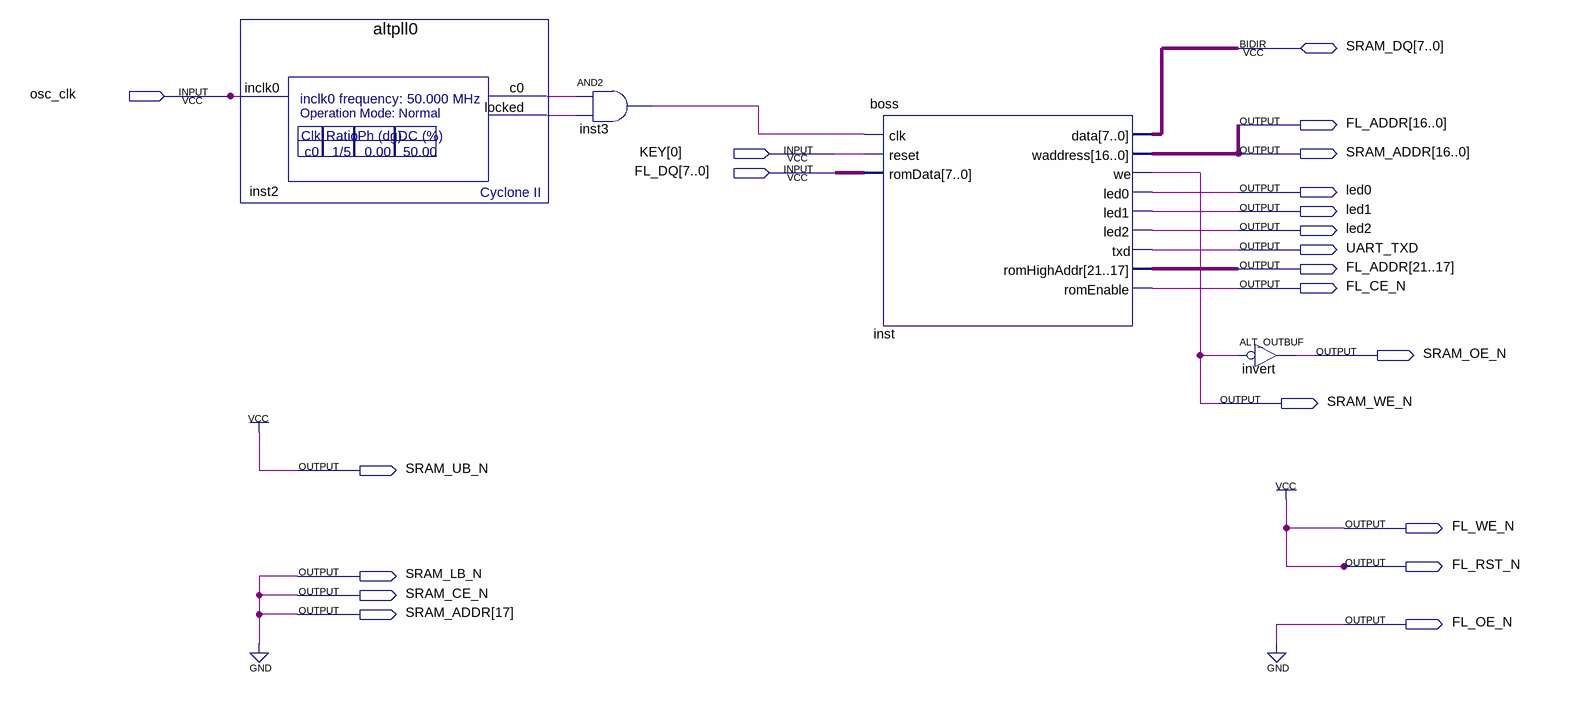
[diagram p0: schematic sheet]
// Quartus schematic ZMachine.bdf as structural Verilog: 4 symbols, 21 pins
module ZMachine (
  input  osc_clk,
  input  [0:0] KEY,
  input  [7:0] FL_DQ,
  inout  [7:0] SRAM_DQ,
  output [21:0] FL_ADDR,
  output [17:0] SRAM_ADDR,
  output led0,
  output led1,
  output led2,
  output UART_TXD,
  output FL_CE_N,
  output SRAM_OE_N,
  output SRAM_WE_N,
  output SRAM_UB_N,
  output FL_WE_N,
  output FL_RST_N,
  output SRAM_LB_N,
  output SRAM_CE_N,
  output FL_OE_N
);

  wire inst2_c0, inst2_locked, inst3_out;

  altpll0 inst2 (.inclk0(osc_clk), .c0(inst2_c0), .locked(inst2_locked));
  and inst3 (inst3_out, inst2_c0, inst2_locked);
  boss inst (
    .clk(inst3_out), .reset(KEY[0]), .romData(FL_DQ), .waddress(FL_ADDR[16:0]), .we(SRAM_WE_N), .led0(led0),
    .led1(led1), .led2(led2), .txd(UART_TXD), .romHighAddr(FL_ADDR[21:17]), .romEnable(FL_CE_N),
    .data(SRAM_DQ));
  ALT_OUTBUF invert (.i(~SRAM_WE_N), .o(SRAM_OE_N));

  assign FL_OE_N = 1'b0;
  assign FL_RST_N = 1'b1;
  assign FL_WE_N = 1'b1;
  assign SRAM_ADDR = {1'b0, FL_ADDR[16:0]};
  assign SRAM_CE_N = 1'b0;
  assign SRAM_LB_N = 1'b0;
  assign SRAM_UB_N = 1'b1;
endmodule
